# EAGLE design Tachometer (EAGLE 8.5.1)
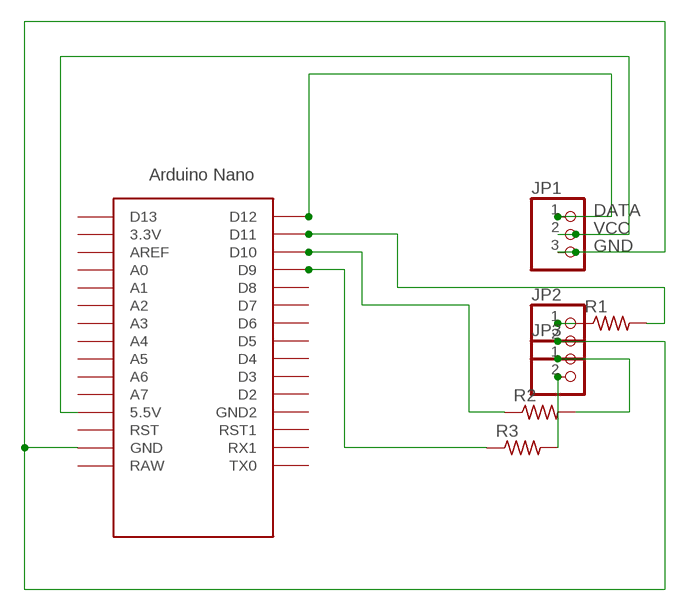
[diagram p0: schematic, sheet 1]

## Parts
JP1  PINHD-1X3  [1X03]
JP2  PINHD-1X2  [1X02]
JP3  PINHD-1X2  [1X02]
R1  R-US_0207/12  [0207/12]
R2  R-US_0207/12  [0207/12]
R3  R-US_0207/12  [0207/12]
U$1  NANO  [NANO]

## Nets
DATA: JP1.1 U$1.D12
GND: JP1.3 JP2.2 U$1.GND
N$1: JP2.1 R1.1
N$2: JP3.2 R3.2
N$3: JP3.1 R2.2
N$4: R1.2 U$1.D11
N$6: R2.1 U$1.D10
N$7: R3.1 U$1.D9
VCC: JP1.2 U$1.5V(5.5V)
Unconnected: U$1.3.3V U$1.A0 U$1.A1 U$1.A2 U$1.A3 U$1.A4 U$1.A5 U$1.A6 U$1.A7 U$1.AREF U$1.D2 U$1.D3 U$1.D4 U$1.D5 U$1.D6 U$1.D7 U$1.D8 U$1.D13 U$1.GND1(GND2) U$1.ICSP1 U$1.ICSP2 U$1.ICSP3 U$1.ICSP4 U$1.ICSP5 U$1.ICSP6 U$1.RAW U$1.RST U$1.RST1 U$1.RX1 U$1.TX0

## Library data of the parts
JP1 = pinhead:PINHD-1X3: PIN HEADER
JP2 JP3 = pinhead:PINHD-1X2: PIN HEADER
R1-R3 = resistor:R-US_: RESISTOR, American symbol
U$1 = Arduino-clone:NANO: Arduino Nano

## Board
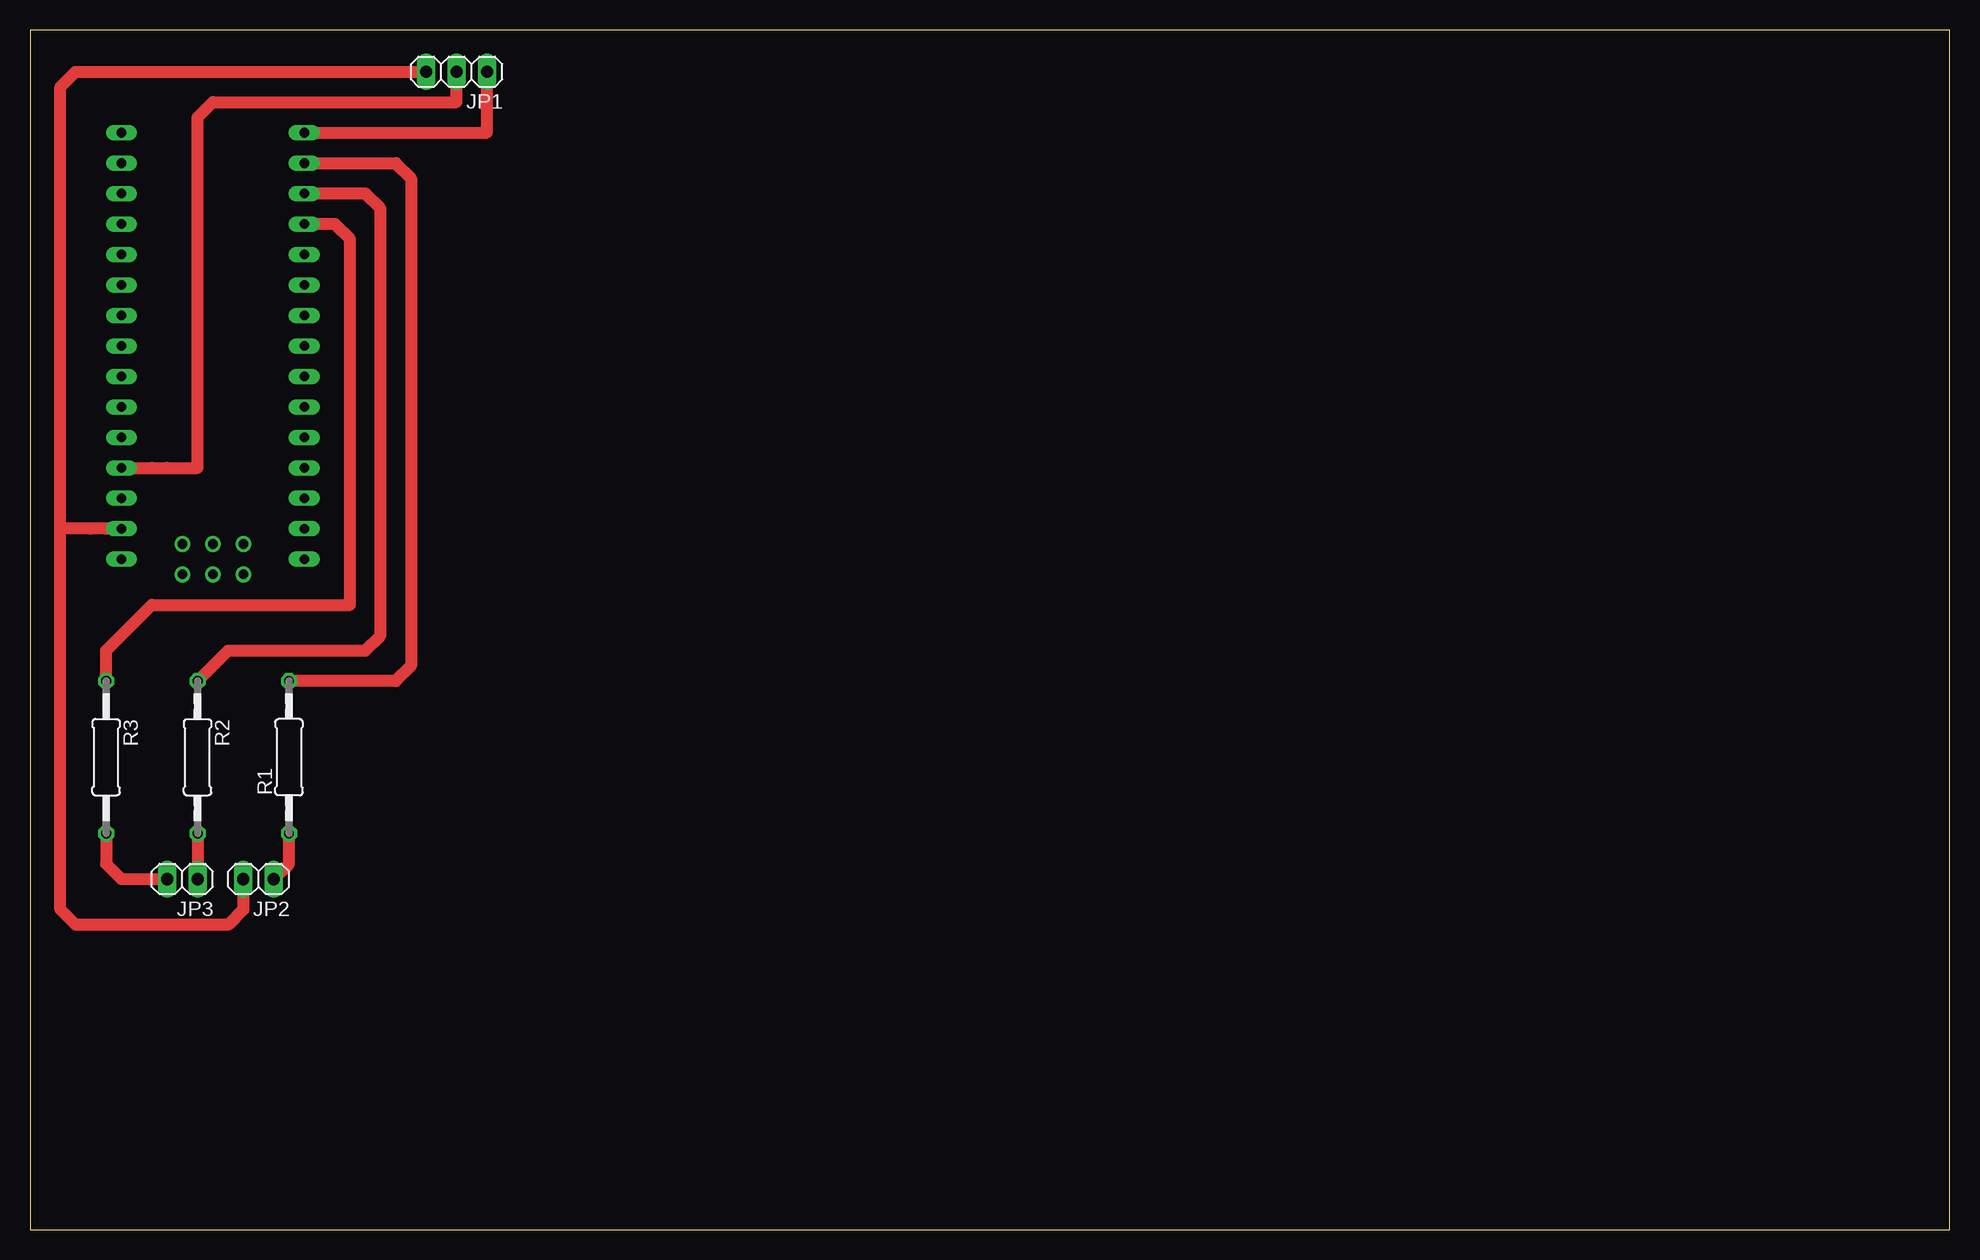
[diagram p1: board, top side]

Size 160 x 100 mm. Coordinates in mm from the lower left corner, seen from the top.
Outline: 0,0 160,0 160,100 0,100 0,0
Copper layers (1*16): Top 0.035mm / dielectric 1.5mm / Bottom 0.035mm
Design rules "default": minimum track width 6mil, minimum drill 0.35mm, track to track 6mil, track to pad 6mil, pad to pad 6mil, via to via 6mil, smd to smd 6mil, copper to edge 40mil, drill to drill 6mil, minimum pad ring 10mil, minimum via ring 8mil, stop-mask expansion 4mil, vias tented up to drill 0mil, thermal gap 10mil

### Footprints (pad centres in the part's own frame; a part is rotated, then mirrored left to right if it is on the bottom)
1X03 = drill 1.016 long: 1 -2.54,0; 2 0,0; 3 2.54,0
1X02 = drill 1.016 long: 1 -1.27,0; 2 1.27,0
0207/12 = drill 0.813 octagon: 1 -6.35,0; 2 6.35,0
NANO = drill 0.8 long: 3.3V -10.16,24.13; 5V -10.16,-1.27; A0 -10.16,19.05; A1 -10.16,16.51; A2 -10.16,13.97; A3 -10.16,11.43; A4 -10.16,8.89; A5 -10.16,6.35; A6 -10.16,3.81; A7 -10.16,1.27; AREF -10.16,21.59; D2 5.08,1.27; D3 5.08,3.81; D4 5.08,6.35; D5 5.08,8.89; D6 5.08,11.43; D7 5.08,13.97; D8 5.08,16.51; D9 5.08,19.05; D10 5.08,21.59; D11 5.08,24.13; D12 5.08,26.67; D13 -10.16,26.67; GND -10.16,-6.35; GND1 5.08,-1.27; RAW -10.16,-8.89; RST -10.16,-3.81; RST1 5.08,-3.81; RX1 5.08,-6.35; TX0 5.08,-8.89 | drill 0.8: ICSP1 -5.08,-10.16; ICSP2 -5.08,-7.62; ICSP3 -2.54,-10.16; ICSP4 -2.54,-7.62; ICSP5 0,-10.16; ICSP6 0,-7.62

### Placement (x,y rotation side)
JP1  35.56,96.52 180 top
JP2  19.05,29.21 180 top
JP3  12.7,29.21 180 top
R1  21.59,39.37 90 top
R2  13.97,39.37 270 top
R3  6.35,39.37 270 top
U$1  17.78,64.77 0 top

### Tracks (layer width: path | path; a pad name or v marks a point on that pad's centre or on a via)
DATA
  Top 1.016: U$1.D12 38.1,91.44 JP1.1
GND
  Top 1.016: U$1.GND 6.35,58.42 5.08,58.42 2.54,58.42 | JP2.2 17.78,26.67 16.51,25.4 3.81,25.4 2.54,26.67 2.54,58.42 | 2.54,58.42 2.54,95.25 3.81,96.52 JP1.3
N$1
  Top 1.016: JP2.1 21.59,30.48 R1.1
N$2
  Top 1.016: R3.2 6.35,30.48 7.62,29.21 JP3.2
N$3  (1 unrouted)
  Top 1.016: R2.2 JP3.1 | JP3.1
N$4
  Top 1.016: U$1.D11 30.48,88.9 31.75,87.63 31.75,46.99 30.48,45.72 R1.2
N$6
  Top 1.016: R2.1 16.51,48.26 27.94,48.26 29.21,49.53 29.21,85.09 27.94,86.36 U$1.D10
N$7
  Top 1.016: R3.1 6.35,48.26 10.16,52.07 26.67,52.07 26.67,82.55 25.4,83.82 U$1.D9
VCC
  Top 1.016: U$1.5V 10.16,63.5 11.43,63.5 13.97,63.5 13.97,92.71 15.24,93.98 35.56,93.98 JP1.2